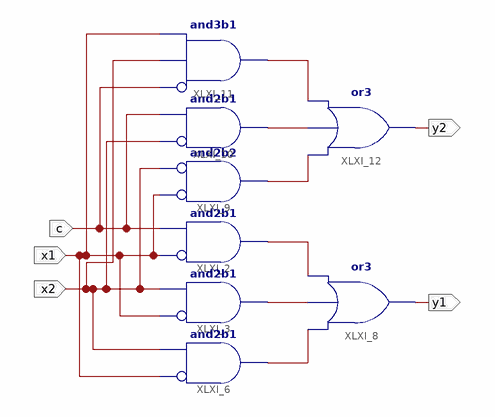
[diagram p0: schematic sheet 1]
// Xilinx ISE schematic des_scheme.sch (xbr) as structural Verilog: 8 symbols, 5 ports
module des_scheme (
  input  c,
  input  x1,
  input  x2,
  output y1,
  output y2
);

  wire XLXN_13, XLXN_14, XLXN_15, XLXN_24, XLXN_25, XLXN_26;

  and XLXI_2 (XLXN_13, ~x1, c);  // and2b1
  and XLXI_3 (XLXN_14, ~x1, x2);  // and2b1
  and XLXI_6 (XLXN_15, ~x1, x2);  // and2b1
  or XLXI_8 (y1, XLXN_15, XLXN_14, XLXN_13);
  and XLXI_9 (XLXN_24, ~x1, ~x2);  // and2b2
  and XLXI_10 (XLXN_25, ~x2, c);  // and2b1
  and XLXI_11 (XLXN_26, ~c, x2, x1);  // and3b1
  or XLXI_12 (y2, XLXN_24, XLXN_25, XLXN_26);
endmodule
